# Altium schematic sheet RTDBank.SchDoc
size 155 x 512 mm
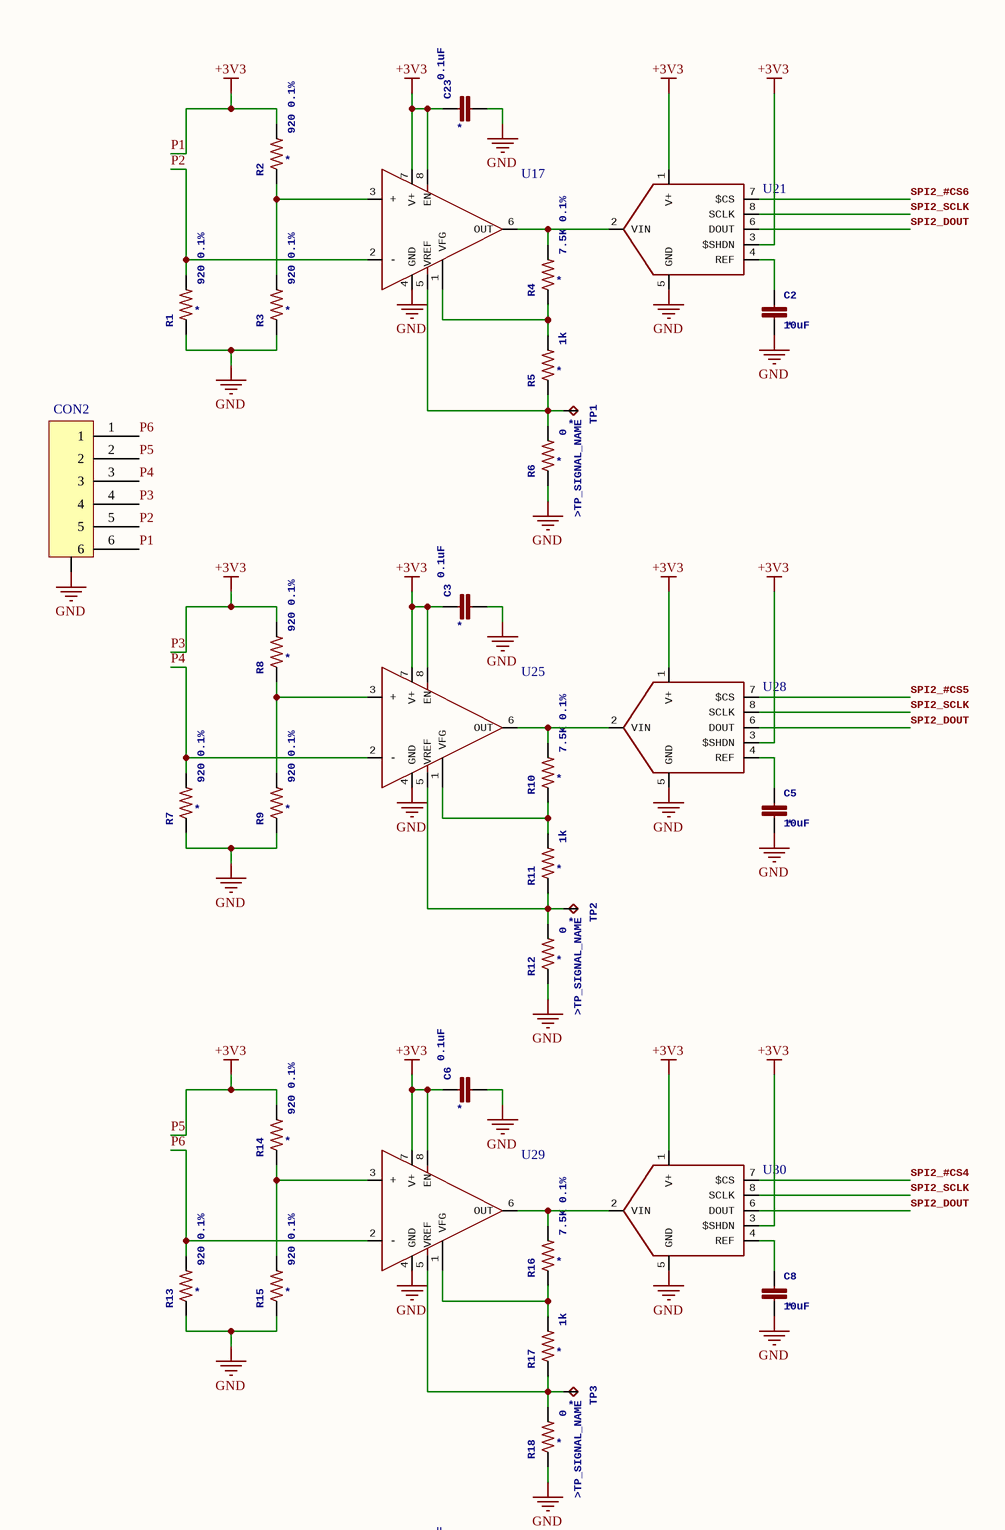
[diagram p0: RTDBank.SchDoc, top]
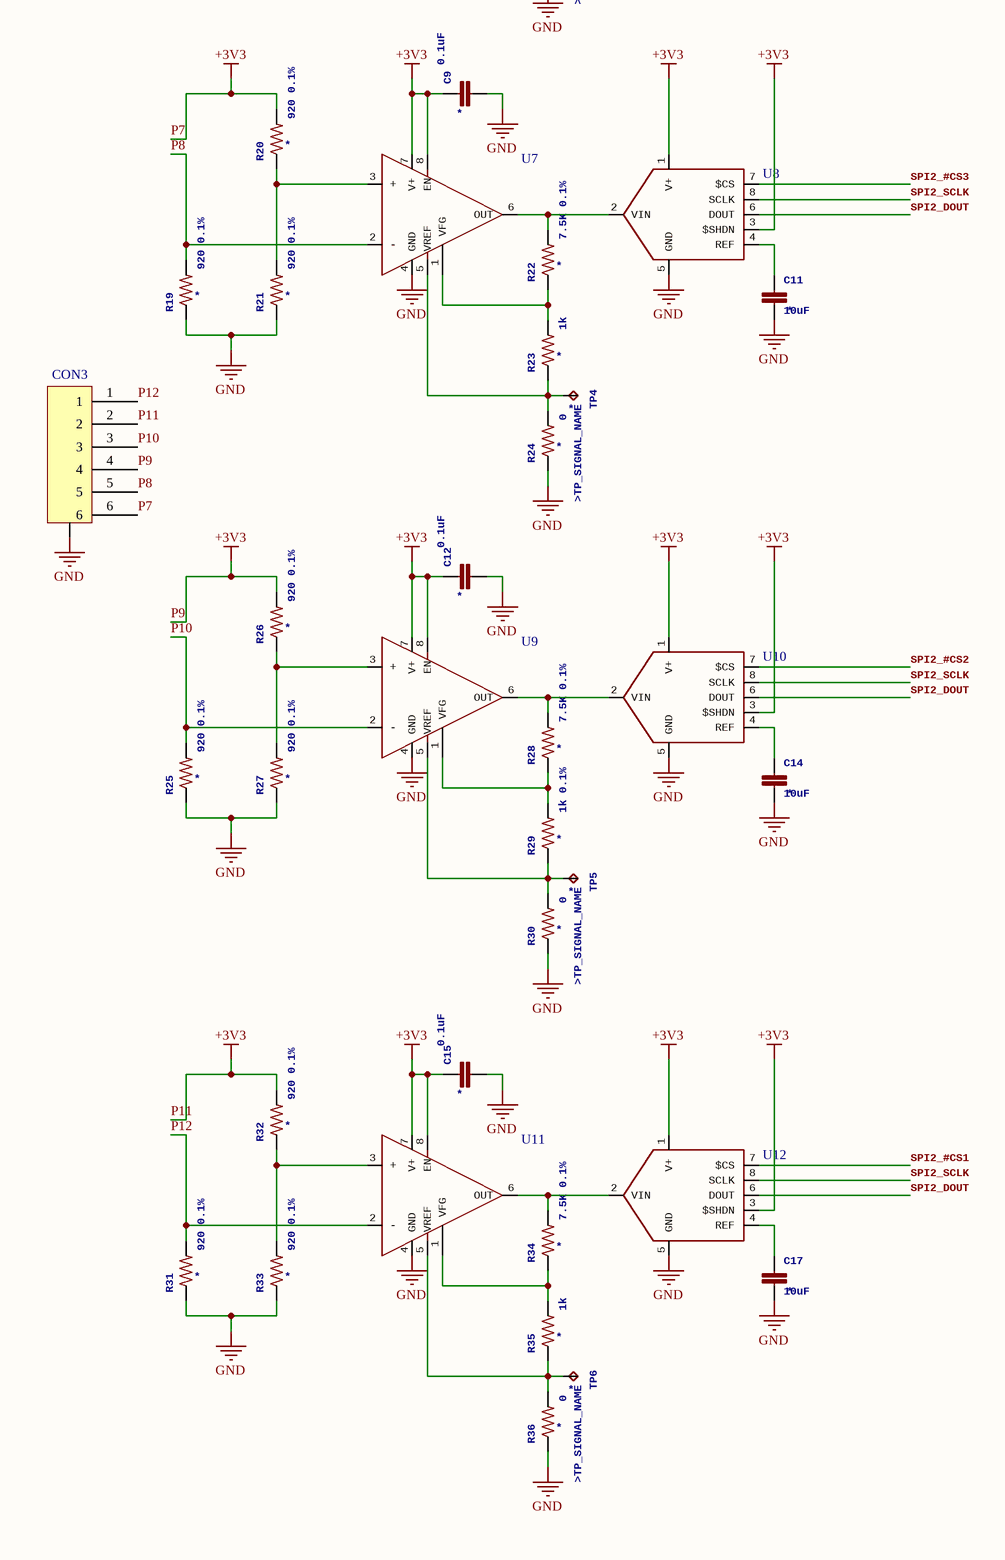
[diagram p1: RTDBank.SchDoc, bottom]

## Parts
C2  10uF  [0603]
C3  0.1uF  [0402 B]
C5  10uF  [0603]
C6  0.1uF  [0402 B]
C8  10uF  [0603]
C9  0.1uF  [0402 B]
C11  10uF  [0603]
C12  0.1uF  [0402 B]
C14  10uF  [0603]
C15  0.1uF  [0402 B]
C17  10uF  [0603]
C23  0.1uF  [0402 B]
CON2  T1M-06-F-SH-L-K  [T1M-06-F-SH-L-K]  (value not drawn)
CON3  T1M-06-F-SH-L-K  [T1M-06-F-SH-L-K]  (value not drawn)
R1  920 0.1%  [0603R]
R2  920 0.1%  [0603R]
R3  920 0.1%  [0603R]
R4  7.5K 0.1%  [0603R]
R5  1k  [0603R]
R6  0  [0603R]
R7  920 0.1%  [0603R]
R8  920 0.1%  [0603R]
R9  920 0.1%  [0603R]
R10  7.5K 0.1%  [0603R]
R11  1k  [0603R]
R12  0  [0603R]
R13  920 0.1%  [0603R]
R14  920 0.1%  [0603R]
R15  920 0.1%  [0603R]
R16  7.5K 0.1%  [0603R]
R17  1k  [0603R]
R18  0  [0603R]
R19  920 0.1%  [0603R]
R20  920 0.1%  [0603R]
R21  920 0.1%  [0603R]
R22  7.5K 0.1%  [0603R]
R23  1k  [0603R]
R24  0  [0603R]
R25  920 0.1%  [0603R]
R26  920 0.1%  [0603R]
R27  920 0.1%  [0603R]
R28  7.5K 0.1%  [0603R]
R29  1k 0.1%  [0603R]
R30  0  [0603R]
R31  920 0.1%  [0603R]
R32  920 0.1%  [0603R]
R33  920 0.1%  [0603R]
R34  7.5K 0.1%  [0603R]
R35  1k  [0603R]
R36  0  [0603R]
TP1  TP_SIGNAL_NAME: >TP_SIGNAL_NAME  [B1,27]  (hidden comment: TPB1,27)
TP2  TP_SIGNAL_NAME: >TP_SIGNAL_NAME  [B1,27]  (hidden comment: TPB1,27)
TP3  TP_SIGNAL_NAME: >TP_SIGNAL_NAME  [B1,27]  (hidden comment: TPB1,27)
TP4  TP_SIGNAL_NAME: >TP_SIGNAL_NAME  [B1,27]  (hidden comment: TPB1,27)
TP5  TP_SIGNAL_NAME: >TP_SIGNAL_NAME  [B1,27]  (hidden comment: TPB1,27)
TP6  TP_SIGNAL_NAME: >TP_SIGNAL_NAME  [B1,27]  (hidden comment: TPB1,27)
U7  MCP6N11  [SOIC8]  (value not drawn)
U8  MAX1240  [SOIC8]  (value not drawn)
U9  MCP6N11  [SOIC8]  (value not drawn)
U10  MAX1240  [SOIC8]  (value not drawn)
U11  MCP6N11  [SOIC8]  (value not drawn)
U12  MAX1240  [SOIC8]  (value not drawn)
U17  MCP6N11  [SOIC8]  (value not drawn)
U21  MAX1240  [SOIC8]  (value not drawn)
U25  MCP6N11  [SOIC8]  (value not drawn)
U28  MAX1240  [SOIC8]  (value not drawn)
U29  MCP6N11  [SOIC8]  (value not drawn)
U30  MAX1240  [SOIC8]  (value not drawn)

## Nets
GND: C2.2 C3.2 C5.2 C6.2 C8.2 C9.2 C11.2 C12.2 C14.2 C15.2 C17.2 C23.2 CON2.GND CON3.GND R1.1 R3.1 R6.1 R7.1 R9.1 R12.1 R13.1 R15.1 R18.1 R19.1 R21.1 R24.1 R25.1 R27.1 R30.1 R31.1 R33.1 R36.1 U7.4(GND) U8.5(GND) U9.4(GND) U10.5(GND) U11.4(GND) U12.5(GND) U17.4(GND) U21.5(GND) U25.4(GND) U28.5(GND) U29.4(GND) U30.5(GND)
P1: C3.1 C6.1 C9.1 C12.1 C15.1 C23.1 CON2.2 CON2.4 CON2.6 CON3.2 CON3.4 CON3.6 R2.2 R8.2 R14.2 R20.2 R26.2 R32.2 U7.7(V+) U7.8(EN) U8.1(V+) U8.3($SHDN) U9.7(V+) U9.8(EN) U10.1(V+) U10.3($SHDN) U11.7(V+) U11.8(EN) U12.1(V+) U12.3($SHDN) U17.7(V+) U17.8(EN) U21.1(V+) U21.3($SHDN) U25.7(V+) U25.8(EN) U28.1(V+) U28.3($SHDN) U29.7(V+) U29.8(EN) U30.1(V+) U30.3($SHDN)  [also labelled +3V3, P11, P3, P5, P7, P9]
P2: CON2.5 R1.2 U17.2(-)
P4: CON2.3 R7.2 U25.2(-)
P6: CON2.1 R13.2 U29.2(-)
P8: CON3.5 R19.2 U7.2(-)
P10: CON3.3 R25.2 U9.2(-)
P12: CON3.1 R31.2 U11.2(-)
SPI2_#CS1: U12.7($CS)
SPI2_#CS2: U10.7($CS)
SPI2_#CS3: U8.7($CS)
SPI2_#CS4: U30.7($CS)
SPI2_#CS5: U28.7($CS)
SPI2_#CS6: U21.7($CS)
SPI2_DOUT: U8.6(DOUT) U10.6(DOUT) U12.6(DOUT) U21.6(DOUT) U28.6(DOUT) U30.6(DOUT)
SPI2_SCLK: U8.8(SCLK) U10.8(SCLK) U12.8(SCLK) U21.8(SCLK) U28.8(SCLK) U30.8(SCLK)
NetC2_1: C2.1 U21.4(REF)
NetC5_1: C5.1 U28.4(REF)
NetC8_1: C8.1 U30.4(REF)
NetC11_1: C11.1 U8.4(REF)
NetC14_1: C14.1 U10.4(REF)
NetC17_1: C17.1 U12.4(REF)
NetR2_1: R2.1 R3.2 U17.3(+)
NetR4_1: R4.1 R5.2 U17.1(VFG)
NetR4_2: R4.2 U17.6(OUT) U21.2(VIN)
NetR5_1: R5.1 R6.2 TP1.TP U17.5(VREF)
NetR8_1: R8.1 R9.2 U25.3(+)
NetR10_1: R10.1 R11.2 U25.1(VFG)
NetR10_2: R10.2 U25.6(OUT) U28.2(VIN)
NetR11_1: R11.1 R12.2 TP2.TP U25.5(VREF)
NetR14_1: R14.1 R15.2 U29.3(+)
NetR16_1: R16.1 R17.2 U29.1(VFG)
NetR16_2: R16.2 U29.6(OUT) U30.2(VIN)
NetR17_1: R17.1 R18.2 TP3.TP U29.5(VREF)
NetR20_1: R20.1 R21.2 U7.3(+)
NetR22_1: R22.1 R23.2 U7.1(VFG)
NetR22_2: R22.2 U7.6(OUT) U8.2(VIN)
NetR23_1: R23.1 R24.2 TP4.TP U7.5(VREF)
NetR26_1: R26.1 R27.2 U9.3(+)
NetR28_1: R28.1 R29.2 U9.1(VFG)
NetR28_2: R28.2 U9.6(OUT) U10.2(VIN)
NetR29_1: R29.1 R30.2 TP5.TP U9.5(VREF)
NetR32_1: R32.1 R33.2 U11.3(+)
NetR34_1: R34.1 R35.2 U11.1(VFG)
NetR34_2: R34.2 U11.6(OUT) U12.2(VIN)
NetR35_1: R35.1 R36.2 TP6.TP U11.5(VREF)

## Library data of the parts
C2 C5 C8 C11 C14 C17 = C-EUC0603K: CAPACITOR, European symbol; GateName_1: G$1; SymbolName_1: C-EU; DeviceName: C0603K; LibraryName: rcl; DeviceSetName: C-EU; NAME: *
C3 C6 C9 C12 C15 C23 = C-EUC0402K: CAPACITOR, European symbol; GateName_1: G$1; SymbolName_1: C-EU; DeviceName: C0402K; LibraryName: rcl; DeviceSetName: C-EU; NAME: *
CON2 CON3 = T1M-06-F-SH-L-K: 6 Positions Header Connector Surface Mount, Right Angle; Manufacturer: Samtec; Supplier 1: Digi-Key; Manufacturer Part Number: T1M-06-F-SH-L-K; Stock 1: 0; Supplier Part Number 1: SAM11991-ND
R1-R36 = R-US_R0603: RESISTOR, American symbol; GateName_1: G$1; SymbolName_1: R-US; DeviceName: R0603; DeviceSetName: R-US_; LibraryName: rcl; NAME: *
TP1-TP6 = TPB1,27: Test pad; GateName_1: G$1; SymbolName_1: TP; DeviceName: B1,27; LibraryName: testpad; DeviceSetName: TP; NAME: *
U7 U9 U11 U17 U25 U29 = MCP6N11: GateName_1: G$1; SymbolName_1: MCP6N11; LibraryName: custom; DeviceSetName: MCP6N11
U8 U10 U12 U21 U28 U30 = MAX1240: GateName_1: G$1; SymbolName_1: MAX1240; LibraryName: custom; DeviceSetName: MAX1240